# Altium schematic sheet Drogue Pyro.SchDoc
size A4; SheetNumber: 3; SheetTotal: 7
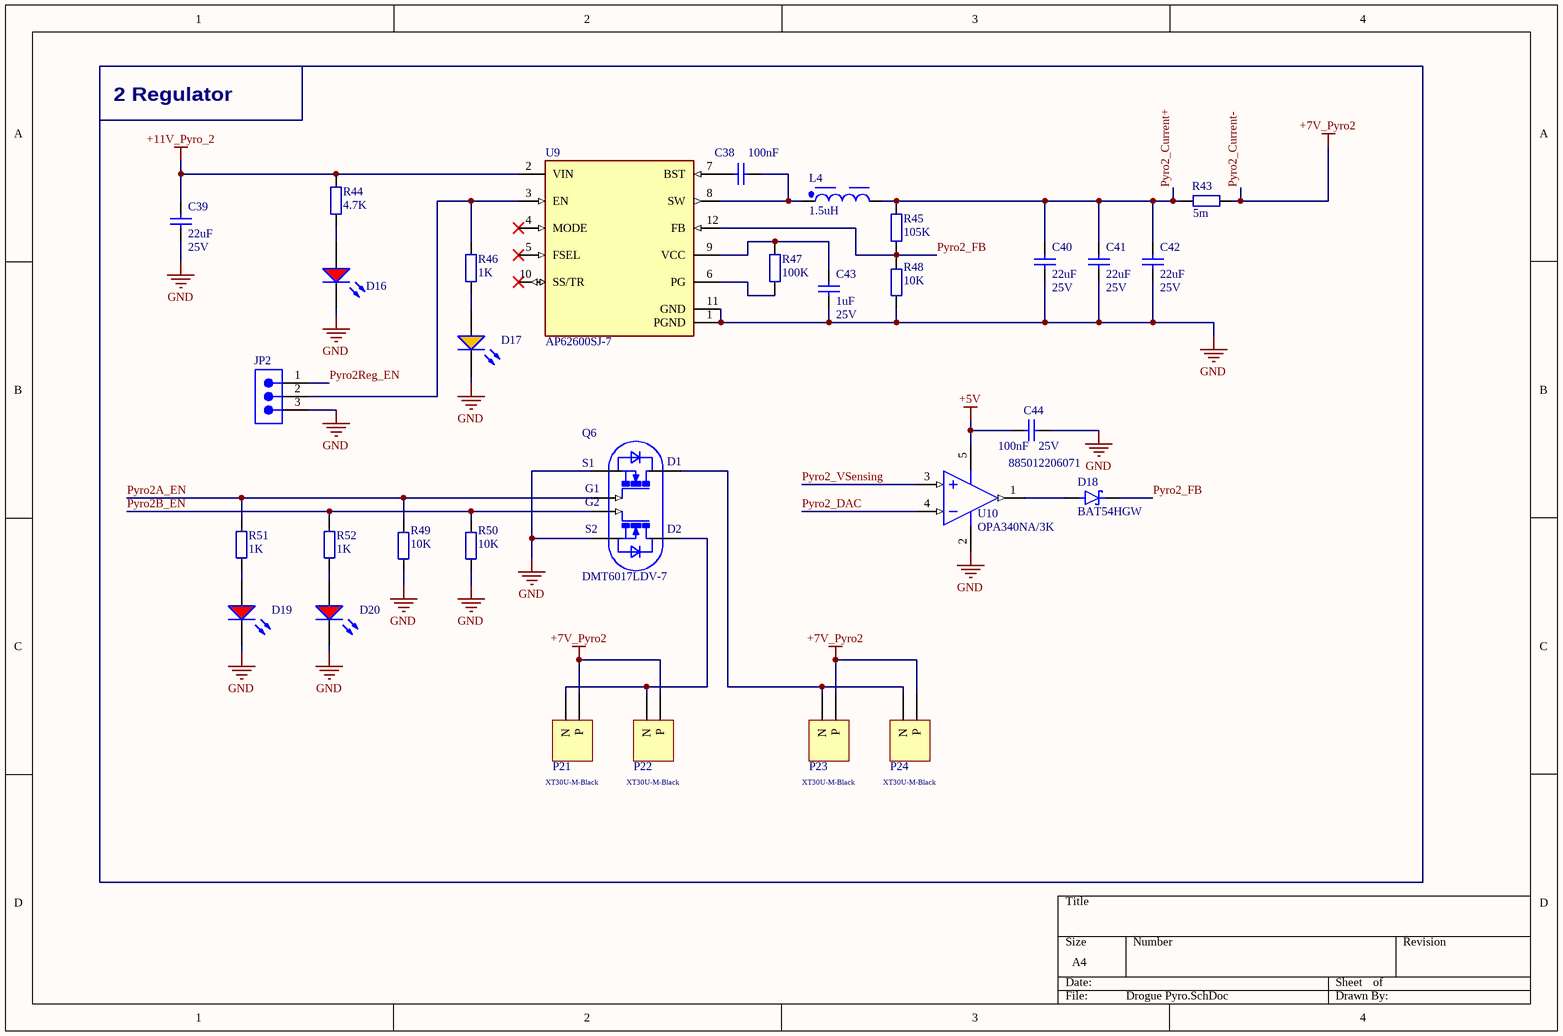
[diagram p0: Drogue Pyro.SchDoc]

## Parts
C38  value 100nF  [MY_0603]  (hidden comment: Cap ceramic)
C39  22uF  Voltage: 25V  [MY_0805]
C40  22uF  Voltage: 25V  [MY_0805]
C41  22uF  Voltage: 25V  [MY_0805]
C42  22uF  Voltage: 25V  [MY_0805]
C43  value 1uF  Volte: 25V  [MY_0603]  (hidden comment: Cap ceramic)
C44  value 100nF  Voltage: 25V  Manufacturer Part Number: 885012206071  [MY_0603]  (hidden comment: Cap ceramic)
D16  150080RS75000  [WL-SMCW_0805_150080xx75000]  (value not drawn)
D17  150080AS75000  [WL-SMCW_0805_150080xx75000]  (value not drawn)
D18  BAT54HGW  [BAT54HGW-Footprint-1]
D19  150080RS75000  [WL-SMCW_0805_150080xx75000]  (value not drawn)
D20  150080RS75000  [WL-SMCW_0805_150080xx75000]  (value not drawn)
JP2  Jumper 3 pin, 2,54mm  [Jumper 3 pin, 2,54mm-Footprint-1]  (value not drawn)
L4  1.5uH  [WE-MAPI_4020]
P21  XT30U-M-Black  [XT30-Footprint-2]
P22  XT30U-M-Black  [XT30-Footprint-2]
P23  XT30U-M-Black  [XT30-Footprint-2]
P24  XT30U-M-Black  [XT30-Footprint-2]
Q6  DMT6017LDV-7  [DMT6017LDV-7-Footprint-1]
R43  5m  [R0612]
R44  4.7K  [R0603-0.45]
R45  105K  [R0603-0.45]
R46  1K  [R0603-0.45]
R47  100K  [R0603-0.45]
R48  10K  [R0603-0.45]
R49  10K  [R0603-0.45]
R50  10K  [R0603-0.45]
R51  1K  [R0603-0.45]
R52  1K  [R0603-0.45]
U9  AP62600SJ-7  [FP-V-QFN2030-12_Type_A-MFG]
U10  OPA340NA/3K  [DBV0005A_M]

## Blocks framed on the sheet
2 Regulator: C38-C44 D16-D20 JP2 L4 P21-P24 Q6 R43-R52 U9 U10

## Nets
+5V: C44.2 U10.5(V+)
+11V_Pyro_2: C39.1 R44.2 U9.2(VIN)
GND: C39.2 C40.2 C41.2 C42.2 C43.1 C44.1 D16.1(K) D17.1(K) D19.1(K) D20.1(K) JP2.3 Q6.1(S1) Q6.3(S2) R48.2 R49.2 R50.2 U9.1(PGND) U9.11(GND) U10.2(V-)
Pyro2_Current-: P21.P P22.P P23.P P24.P R43.2  [also labelled +7V_Pyro2]
Pyro2_Current+: C40.1 C41.1 C42.1 L4.2 R43.1 R45.1
Pyro2_DAC: U10.4(IN-)
Pyro2_FB: D18.C(K) R45.2 R48.1 U9.12(FB)
Pyro2_VSensing: U10.3(IN+)
Pyro2A_EN: Q6.2(G1) R49.1 R51.2
Pyro2B_EN: Q6.4(G2) R50.1 R52.2
Pyro2Reg_EN: JP2.1
NetC38_1: C38.1 L4.1 U9.8(SW)
NetC38_2: C38.2 U9.7(BST)
NetC43_2: C43.2 R47.1 U9.9(VCC)
NetD16_2: D16.2(A) R44.1
NetD17_2: D17.2(A) R46.1
NetD18_A: D18.A U10.1(OUT)
NetD19_2: D19.2(A) R51.1
NetD20_2: D20.2(A) R52.1
NetJP2_2: JP2.2 R46.2 U9.3(EN)
NetP21_N: P21.N P22.N Q6.6(D2)
NetP23_N: P23.N P24.N Q6.8(D1)
NetR47_2: R47.2 U9.6(PG)

Not connected (* = marked no-connect by the designer): U9 4(MODE)* 5(FSEL)* 10(SS/TR)*

## Library data of the parts
C38 = CMP-015-000000-1: Capacitor, 100nF, 0603, 25V; Manufacturer: Wurth Elektronik; Manufacturer Part Number: 885012206071; Voltage: 25V; ClassName: 2PyroREG
C39-C42 = CMP-015-000000-1: Capacitor, 22uF, 0805, 25V; Manufacturer: Samsung; Manufacturer Part Number: CL21A226MAYNNNE; ClassName: REG5V
C43 = CMP-015-000000-1: Capacitor, 1uF, 0603, 25V; Manufacturer: Wurth Elektronik; Manufacturer Part Number: 885012206052; ClassName: 2PyroREG
C44 = CMP-015-000000-1: Capacitor, 100nF, 0603, 25V; Manufacturer: Wurth Elektronik; ClassName: 1Pyro OPAMP
D16 D19 D20 = CMP-1426-00011-2: LED, 0805, Red; NexarPartId: 29717781; Manufacturer: Wurth Elektronik; Peak Wavelength: 630nm; Wavelength: 625nm; Viewing Angle: 140°; Test Current: 20mA; Forward Voltage: 2V; Forward Current: 100mA; Lens Style: Clear, Rectangular; Luminous Intensity: 150mcd; Max Reverse Voltage (DC): 5V; Length: 2mm; Case Code (Imperial): 0805; RoHS: Compliant; Max Operating Temperature: 85°C; Height: 700µm; Packaging: Tape and Reel; Color: Red; Case/Package: 0805; REACH SVHC: Unknown; Dominant Wavelength: 625nm; Min Operating Temperature: -40°C; Case Code (Metric): 2012; Mount: Surface Mount; Width: 1.25mm; Manufacturer Part Number: 150080RS75000
D17 = CMP-03913-89970695-1: Amber; Manufacturer: Wurth Elektronik; Manufacturer Part Number: 150080AS75000
D18 = CMP-100-000001-3: BAT54HGW Schotty Diode; Manufacturer: Nexperia; Manufacturer Part Number: BAT54HGW
JP2 = CMP-002-00265-1
L4 = CMP-03913-66963831-2: 74438356015 Fixed Ind 1.5UH 5.8A 19 Mohm SMD; Manufacturer: Wurth Elektronik; Manufacturer Part Number: 74438356015; ClassName: 2PyroREG
P21-P24 = CMP-002-00004-11: XT30PW-M公头 Socket,DCsupply,XT30,male,PIN:2; Manufacturer: AMASS; Manufacturer Part Number: XT30U-M-Black
Q6 = CMP-013-00011-1: Small Signal Field-Effect Transistor; RoHS Compliant: Yes
R43 = CMP-009-000000-6: Resistor, 5m, 0612, 2W; Manufacturer: Vishay; Manufacturer Part Number: WFCP06125L000FE66; ClassName: 2Pyro OPAMP
R44 = CMP-009-000000-3: Resistor, 4.7K, 0603, 0.1W; Manufacturer: Wurth; Manufacturer Part Number: 560112116006; Power Disipation: 0.1W
R45 = R: Resistor, 105K, 0603, 0.1W; Manufacturer: Wurth; Manufacturer Part Number: 560112110183; Power Disipation: 0.1W; ClassName: 2PyroREG
R46 R51 R52 = CMP-009-000000-3: Resistor, 1K, 0603, 0.1W; Manufacturer: Wurth; Manufacturer Part Number: 560112116014; Power Disipation: 0.1W
R47 = R: Resistor, 100K, 0603, 0.1W; Manufacturer: Wurth; Manufacturer Part Number: 560112116004; Power Disipation: 0.1W; ClassName: REG5V
R48-R50 = R: Resistor, 10K, 0603, 0.1W; Manufacturer: Wurth; Manufacturer Part Number: 560112116005; Power Disipation: 0.1W
  R48 R49: ClassName: 2PyroREG
  R50: ClassName: DroguePyroREG
U9 = CMP-012-00004-1: Switching Regulator, 1200kHz Switching Freq-Max; Manufacturer: Diodes Incorporated; Manufacturer Part Number: AP62600SJ-7; ClassName: 2PyroREG
U10 = CMP-0272-00929-3: Single-Supply, Rail-to-Rail Operational Amplifier MicroAmplifier(TM) Series, 2.7 to 5.5 V, -40 to 85 degC, 5-pin SOT23 (DBV5), Green (RoHS & no Sb/Br); Manucaturer: Texas Instruments; ComponentLink3URL: http://www.ti.com/litv/pdf/mpds018i; ComponentLink1Description: Manufacturer URL; ComponentLink1URL: http://www.ti.com/; ComponentLink3Description: Package Specification; ComponentLink2URL: http://www.ti.com/general/docs/lit/getliterature.tsp?genericPartNumber=OPA340&fileType=pdf; ComponentLink2Description: Datasheet; Manufacturer Part Number: OPA340NA/3K